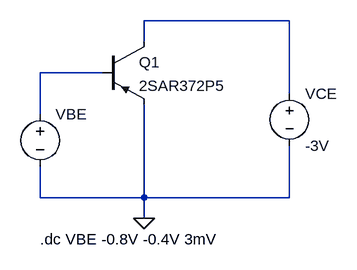
[diagram p0: schematic Fig1.asc]
Fig1.asc, the LTspice schematic file:
Version 4
SHEET 1 880 680
WIRE 688 208 464 208
WIRE 464 240 464 208
WIRE 400 288 304 288
WIRE 688 320 688 208
WIRE 304 352 304 288
WIRE 304 480 304 432
WIRE 464 480 464 336
WIRE 464 480 304 480
WIRE 688 480 688 400
WIRE 688 480 464 480
WIRE 464 512 464 480
FLAG 464 512 0
SYMBOL pnp 400 240 R0
SYMATTR InstName Q1
SYMATTR Value 2SAR372P5
SYMBOL Voltage 688 304 R0
SYMATTR InstName VCE
SYMATTR Value -3V
SYMBOL Voltage 304 336 R0
WINDOW 3 24 96 Invisible 2
SYMATTR Value 3V
SYMATTR InstName VBE
TEXT 304 544 Left 2 !.dc VBE -0.8V -0.4V 3mV

The netlist it stands for:
* Fig1.asc
Q1 N001 N002 0 0 2SAR372P5
VCE N001 0 -3V
VBE N002 0 3V
.model NPN NPN
.model PNP PNP
.lib standard.bjt
.dc VBE -0.8V -0.4V 3mV
.backanno
.end